# Altium project RC_CarV3.PrjPcb
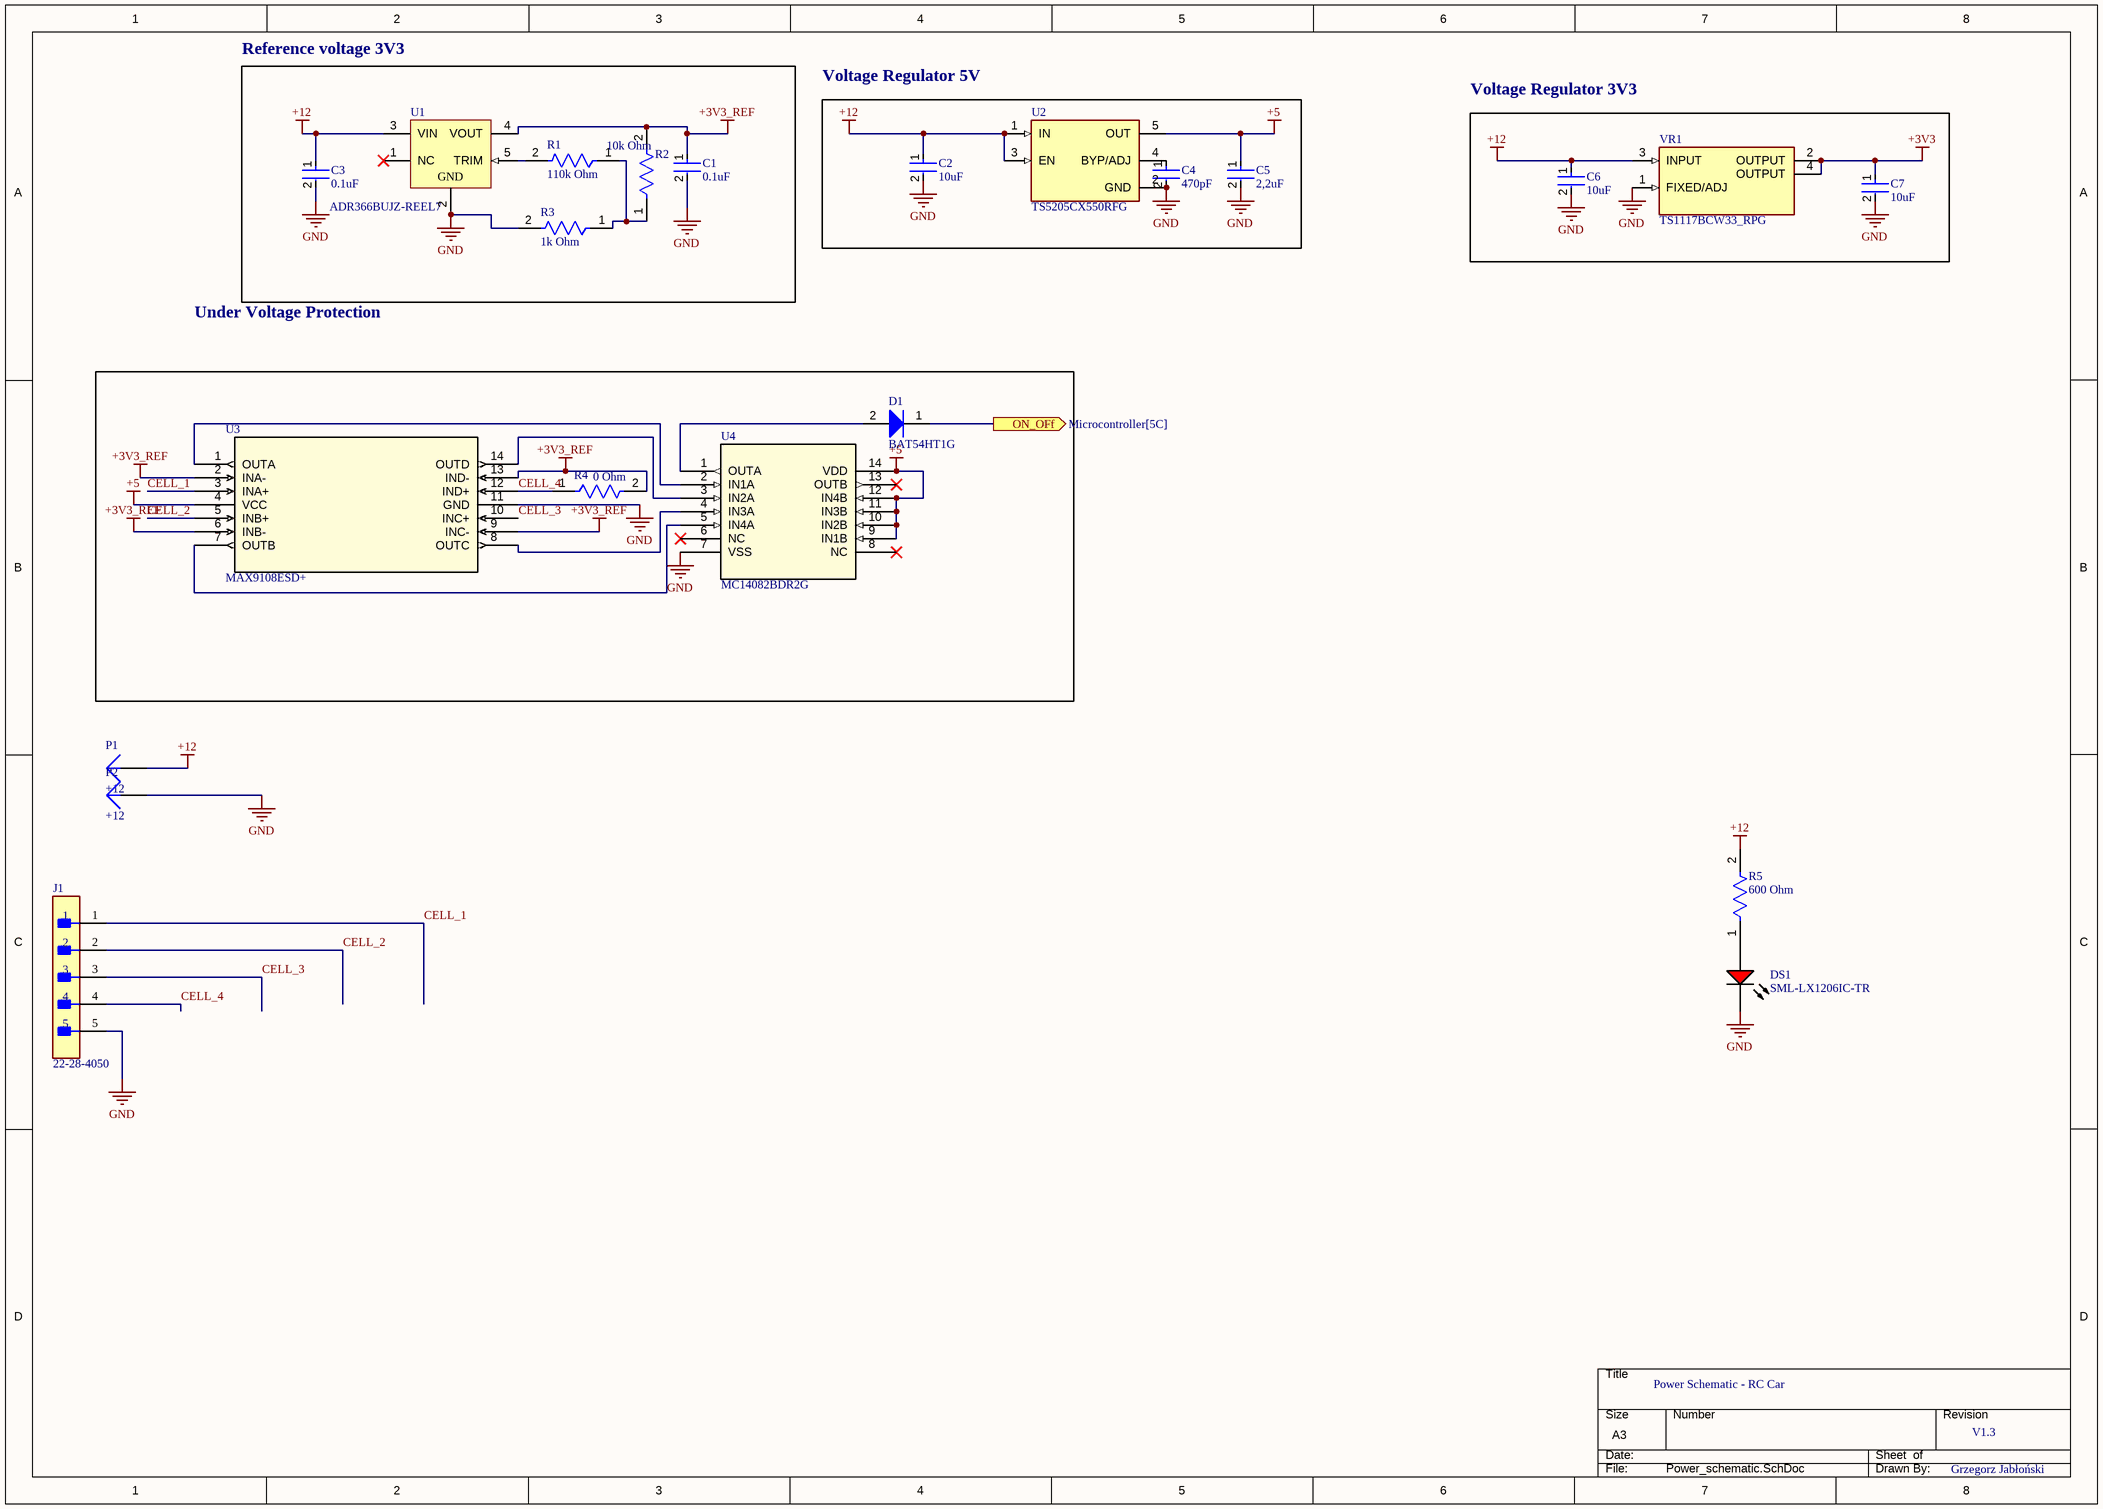
[diagram p0: Power_schematic.SchDoc]
1 sheet, 22 parts. Net scope: flat (ports and power ports of the same name join across sheets).
Board file: PCBV3.PcbDoc

## Sheet Power_schematic.SchDoc: Power Schematic - RC Car
size A3; DrawnBy: Grzegorz Jabłoński; Revision: V1.3; SheetNumber: 1; SheetTotal: 3

### Parts
C1  0.1uF  [FP-CC0805-0_85-MFG]
C2  10uF  [FP-CC0805-0_85-MFG]
C3  0.1uF  [FP-CC0805-0_85-MFG]
C4  470pF  [FP-CC0805-0_85-MFG]
C5  2,2uF  [FP-CC0805-0_85-MFG]
C6  10uF  [FP-CC0805-0_85-MFG]
C7  10uF  [FP-CC0805-0_85-MFG]
D1  BAT54HT1G  [ONSC-SOD-323-2-477-02_V]
DS1  SML-LX1206IC-TR  [LUMX-SML-LX1206IC_V]
J1  22-28-4050  [FP-22-28-4050-MFG]
P1  +12  [PIN1]
P2  +12  [PIN1]
R1  110k Ohm  [FP-RMCF0805-MFG]
R2  10k Ohm  [FP-RMCF0805-MFG]
R3  1k Ohm  [FP-RMCF0805-MFG]
R4  0 Ohm  [FP-RMCF0805-MFG]
R5  600 Ohm  [FP-RMCF0805-MFG]
U1  ADR366BUJZ-REEL7  [ADI-UJ-5_L]
U2  TS5205CX550RFG  [SOT95P270X125-5N]
U3  MAX9108ESD+  [21-0041B_14]
U4  MC14082BDR2G  [SOIC-14_NB_ONS]
VR1  TS1117BCW33_RPG  [VREG_TS1117BCW50_RPG]

### Blocks framed on the sheet
Reference voltage 3V3: C1 C3 R1-R3 U1

### Ports
ON_OFf (out, see Microcontroller[5C])

### Nets
+3V3: C7.1 VR1.2(OUTPUT) VR1.4(OUTPUT)
+3V3_REF: C1.1 R2.2 R4.2 U1.4(VOUT) U3.2(INA-) U3.6(INB-) U3.9(INC-) U3.13(IND-)
+5: C5.1 U2.5(OUT) U3.4(VCC) U4.9(IN1B) U4.10(IN2B) U4.11(IN3B) U4.12(IN4B) U4.14(VDD)
+12: C2.1 C3.1 C6.1 P1.1 R5.2 U1.3(VIN) U2.1(IN) U2.3(EN) VR1.3(INPUT)
GND: C1.2 C2.2 C3.2 C4.2 C5.2 C6.2 C7.2 DS1.2(K) J1.5 P2.1 R3.2 U1.2(GND) U2.2(GND) U3.11(GND) U4.7(VSS) VR1.1(FIXED/ADJ)
CELL_1: J1.1 U3.3(INA+)
CELL_2: J1.2 U3.5(INB+)
CELL_3: J1.3 U3.10(INC+)
CELL_4: J1.4 R4.1 U3.12(IND+)
NetC4_1: C4.1 U2.4(BYP/ADJ)
NetD1_1: D1.1(K) ; port ON_OFf
NetD1_2: D1.2(A) U4.1(OUTA)
NetDS1_1: DS1.1(A) R5.1
NetR1_1: R1.1 R2.1 R3.1
NetR1_2: R1.2 U1.5(TRIM)
NetU3_1: U3.1(OUTA) U4.2(IN1A)
NetU3_7: U3.7(OUTB) U4.5(IN4A)
NetU3_8: U3.8(OUTC) U4.4(IN3A)
NetU3_14: U3.14(OUTD) U4.3(IN2A)

Not connected (* = marked no-connect by the designer): U1 1(NC)*; U4 6(NC)* 8(NC)* 13(OUTB)*

### Notes on the sheet
- Voltage Regulator 5V
- Voltage Regulator 3V3
- Under Voltage Protection
- THIS DOCUMENT AND THE DATA DISCLOSED HEREIN OR
- HEREWITH IS THE PROPERTY OF ALTIUM LIMITED AND MAY
- DWG NO:
- REVISION
- REV:
- DESCRIPTION
- DATE
- APPROVED
- BE FREELY DISTRIBUTED IN WHOLE. NO RIGHTS ARE
- RESERVED OR EXPRESS OR IMPLIED WARANTEE GIVEN.
- ENG:
- APPROVALS
- PROJECT
- DSN:
- CHK:
- REFERENCE DOCUMENTS
- PROJECT REVISION:
- TITLE
- DOCUMENT REVISION:
- DESIGN ITEM:
- BOM:
- FAB DWG:
- PCB DWG:
- ASSY DWG:
- SCALE:
- A3
- SIZE
- CAGE CODE
- FILE NAME
- DWG NO.
- SHEET
- OF
- REV

### Library data of the parts
C1-C7 = CMP-2100-03606-3: CAP CER 0.1UF 50V X7R 0805; Manufacturer Part Number: CC0805KRX7R9BB104; Manufacturer: Yageo; Tolerance: 0.1; Capacitance: 100 nF; Value: 100 nF; Material: Ceramic; Device Class L1: Passive Components; ComponentLink2Description: Datasheet; Package: CC0805-0.85; Digikey Description: CAP CER 0.1UF 50V X7R 0805; Device Class L3: Ceramic Capacitors; Temperature: -30°C to +85°C; Temperature Characteristic: X7R; Voltage Rating: 50 V; Height: 0.95mm; RoHS: TRUE; Ipc Land Pattern Name: CAPC200125X85; Device Class L2: Capacitors; Category: Cap; Temperature Range Low: -30°C; Temperature Range High: +85°C; Mouser Description: Multilayer Ceramic Capacitors MLCC - SMD/SMT 100nF 50V X7R 10%; Footprint Url: http://www.yageo.com/exep/pages/download/literatures/UPY-C_GEN_24.pdf; Automotive: No; Octopart: https://octopart.com/cc0805krx7r9bb104-yageo-192993; Lead Free: Yes; ComponentLink2URL: http://www.yageo.com/documents/recent/UPY-GPHC_Y5V_6.3V-to-50V_8.pdf
D1 = CMP-1055-00462-1: Schottky Barrier Diode, 2-Pin SOD-323, Pb-Free, Tape and Reel; Manufacturer: On Semiconductor; Configuration: Single; trr Max (ns): 5; IFSM Max (A): 0.6; ComponentLink3URL: http://www.onsemi.com/pub_link/Collateral/477-02.PDF.1; PackageDescription: 2-Pin SOD, Body 1.7 x 1.25 mm; ComponentLink2URL: http://www.onsemi.cn/pub_link/Collateral/BAT54HT1-D.PDF; ComponentLink3Description: Package Specification; ComponentLink2Description: Datasheet; DatasheetVersion: Rev. 6; PackageReference: SOD-323-2-477-02; RoHS: TRUE; ComponentLink1URL: http://www.onsemi.com/; Packing: Tape and Reel; PartNumber: BAT54HT1G; Mounting Technology: Surface Mount; ComponentLink1Description: Manufacturer URL; PackageVersion: Rev. H, 03/2007
DS1 = CMP-2000-07123-1: LED Red, 65 mW, -40 to 85 degC, 2-Pin SMD, RoHS, Tape and Reel; Manufacturer: Lumex; LED Material: GaAsP; Peak Wavelength: 635nm; Number of LEDs: 1; Viewing Angle: 160; Reverse Voltage: 5(Min)V; Lens Appearance: ColorlessNonDiffused; Intensity: 6mcd; Type: Uni-Color; Pin_Count: 2; Lens Dimensions: 2x1.6x0.5mm; Mounting: SurfaceMount; ECCN: EAR99; RoHS: Unknown; Package Description: 2-Pin Surface Mount Device, Body 3.2 x 1.5 mm; Mounting Technology: SurfaceMount; Dominant Wavelength: N/A; Supplier_Package: SMD; Supplier Standard Pack: 3,000; Color: Red; Dimension: 3.2x1.6x1.1mm; HTS: 8541402000; Part No: SML-LX1206IC-TR; Family: SML-LX1206IC; Supplier: Lumex; Datasheet URL: http://www.lumex.com/content/files/ProductAttachment/SML-LX1206IC-TR.pdf; Package Reference: SML-LX1206IC; Manufacturer URL: http://www.lumexinstruments.com/; Operating Temperature: -25to85C; Packaging: TapeandReel; Datasheet Version: Rev. J, 08/2012
J1 = CMP-00257-00278173-1: 22-28-4050 KK® 254 Breakaway Header, Vertical, 5 Circuits, Tin (Sn) Plating, Mating Pin Length 6.09mm; NexarPartId: 278173; Voltage Rating: 250V; Number of Contacts: 5; Contact Resistance: 20mΩ; Gender: Male; Pitch: 2.54mm; Connector Type: Male Pin; Current Rating: 4A; Glow Wire Compliant: Non-compliant; Max Voltage Rating (DC): 250.25kV; Flammability Rating: UL94 V-0; Min Operating Temperature: 0°C; REACH SVHC: Unknown; Lead Free: Lead Free; Termination: Solder; RoHS: Compliant; Schedule B: 8536694040; Number of Circuits: 5; Mount: Through Hole; Lead Pitch: 2.54mm; Height: 2.29mm; Voltage Rating (DC): 250V; Max Operating Temperature: 75°C; Width: 2.49mm; Radiation Hardening: No; Contact Plating: Tin; Orientation: Vertical; Length: 12.7mm; Number of Rows: 1; Housing Material: Thermoplastic; Contact Material: Brass; Packaging: Bulk; Contact Mating Length: 6.096mm; Housing Color: Black; Color: Black; Number of Positions: 5
P1 P2 = Plug: LatestRevisionDate: 17-Jul-2002; LatestRevisionNote: Re-released for DXP Platform.; Publisher: Altium Limited
R1-R5 = CMP-26527-000017-1: RES 0 OHM JUMPER 1/8W 0805; Power Rating: 125mW; Resistance: 0mR; Depth: 1.25mm; Length: 2mm; Military Standard: Not; Width: 0.049inch; Case Code (Imperial): 0805; Number of Terminations: 2; Mount: Surface Mount; Contact Plating: Tin; Height: 0.026inch; Case/Package: 0805; Min Operating Temperature: -55°C; Composition: Thick Film; Max Operating Temperature: 155°C; Packaging: Tape and Reel; Features: Automotive AEC-Q200; Max Power Dissipation: 125mW; Radiation Hardening: No; Lead Free: Lead Free; Case Code (Metric): 2012
U1 = CMP-0784-00515-1: Low Power, Low Noise Voltage Reference with Sink / Source Capability, 3.3 V Output, 3.6 to 15 V Supply, Industrial, 5-pin SOT23 (UJ-5), Reel; Manufacturer: Analog Devices; Max V Supply (V): 15; Min V Supply (V): 3.6; Automotive Qualified: Yes; Ref Out TC (ppm/C): 9; Vout: 3.3V; ComponentLink1Description: Manufacturer URL; Operating Temp Range: -40 to 125 degC; ComponentLink4Description: URL Link1; Code_JEDEC: MO-193-AB; PackageDescription: 5-Pin Thin Small Outline Transistor Package, Body 2.9 x 1.6 mm, Pitch 0.95 mm; PackageVersion: 100708-A, 10/2008; DatasheetVersion: Rev. D; ComponentLink3Description: Package Specification; ComponentLink1URL: http://www.analog.com/en/index.html; ComponentLink3URL: http:/www.analog.com/static/imported-files/packages/PKG_PDF/TSOT(UJ)/UJ_5.pdf; ComponentLink4URL: Product URL:http://www.analog.com/en/special-linear-functions/voltage-references/adr366/products/product.html; ComponentLink2Description: Datasheet; Packing: Reel; ComponentLink2URL: http://www.analog.com/static/imported-files/data_sheets/ADR360_361_363_364_365_366.pdf; Mounting Technology: Surface Mount; PartNumber: ADR366BUJZ-REEL7; PackageReference: UJ-5
U2 = TS5205CX550RFG: MF: {'manufacturer': u'Taiwan Semiconductor Corporation'}; Package: None; Price: None; Value: *; MP: TS5205CX550RFG; Availability: Unavailable
U3 = MAX9108ESD+: No Description Available; Mfr_Name: Analog Devices / Maxim Integrated; RefDes: RefDes; Type: Type
U4 = MC14082BDR2G: No Description Available; Mfr_Name: onsemi; RefDes: RefDes; Type: Type
VR1 = TS1117BCW50_RPG: Package: None; Price: None; Value: *; MP: TS1117BCW50_RPG; Availability: Unavailable